# Altium schematic sheet taktik.SchDoc
size A4; SheetNumber: 1; SheetTotal: 1
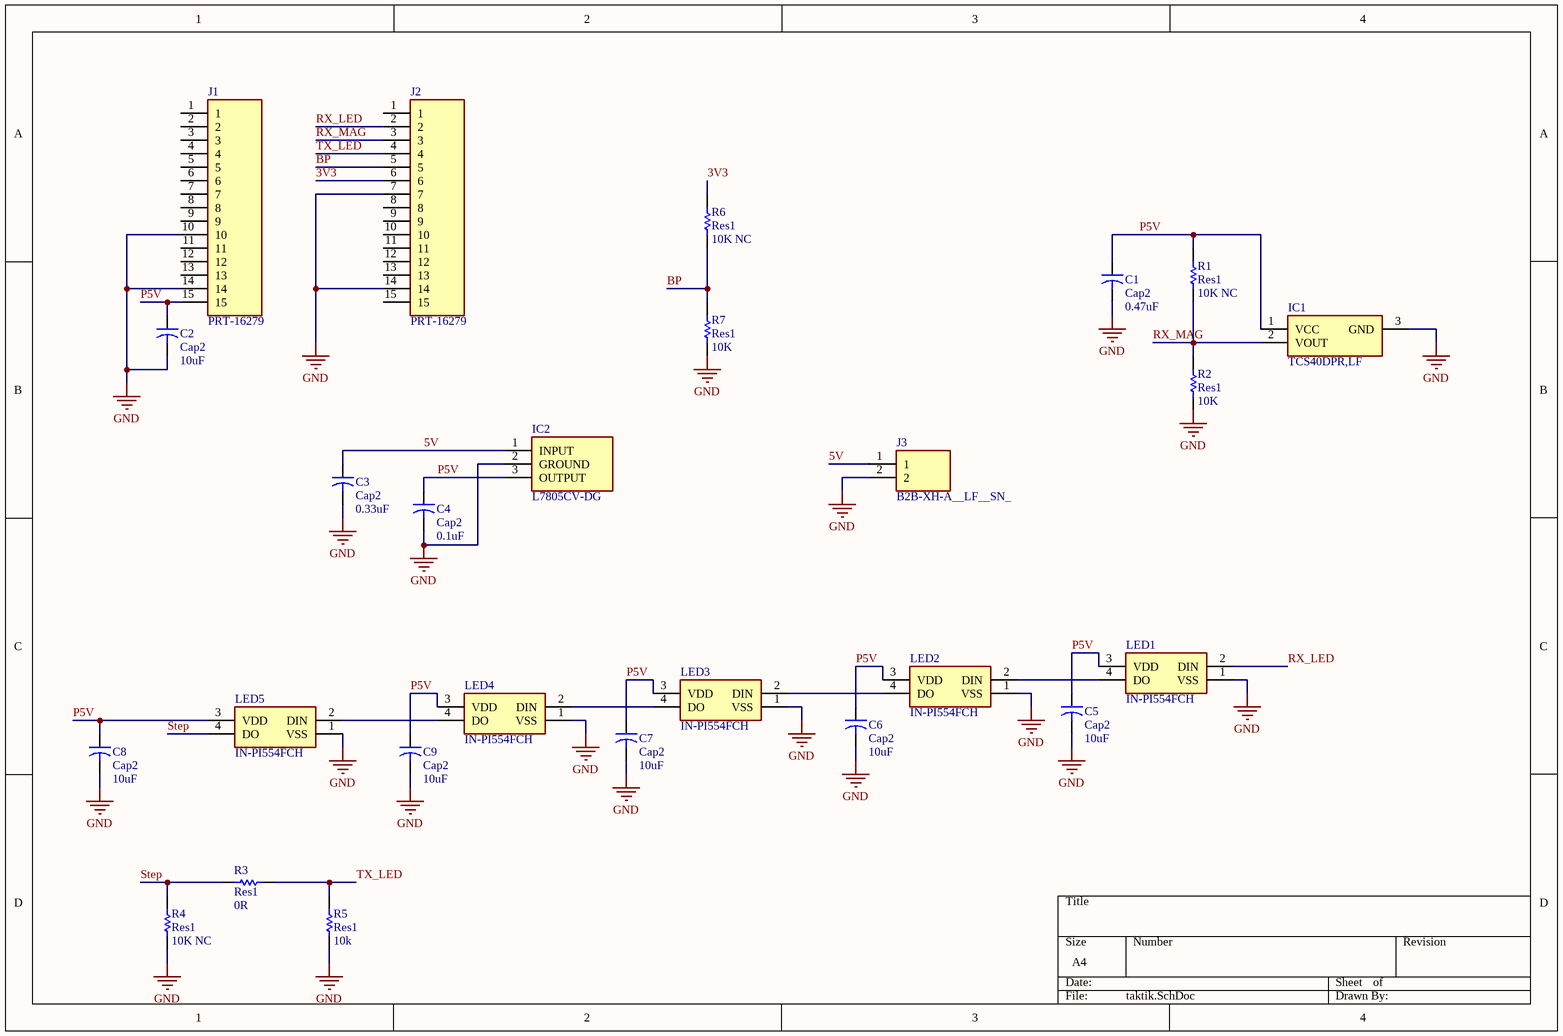
[diagram p0: taktik.SchDoc]

## Parts
C1  Cap2  value 0.47uF  [CAPR5-4X5]
C2  Cap2  value 10uF  [CAPR5-4X5]
C3  Cap2  value 0.33uF  [CAPR5-4X5]
C4  Cap2  value 0.1uF  [CAPR5-4X5]
C5  Cap2  value 10uF  [CAPR5-4X5]
C6  Cap2  value 10uF  [CAPR5-4X5]
C7  Cap2  value 10uF  [CAPR5-4X5]
C8  Cap2  value 10uF  [CAPR5-4X5]
C9  Cap2  value 10uF  [CAPR5-4X5]
IC1  TCS40DPR,LF  [SOTFL95P240X88-3N]
IC2  L7805CV-DG  [TO255P460X1020X2008-3P]
J1  PRT-16279  [PRT16279]
J2  PRT-16279  [PRT16279]
J3  B2B-XH-A__LF__SN_  [SHDR2W64P0X250_1X2_740X575X700P]
LED1  IN-PI554FCH  [INPI554FCH]
LED2  IN-PI554FCH  [INPI554FCH]
LED3  IN-PI554FCH  [INPI554FCH]
LED4  IN-PI554FCH  [INPI554FCH]
LED5  IN-PI554FCH  [INPI554FCH]
R1  Res1  value 10K NC  [AXIAL-0.3]
R2  Res1  value 10K  [AXIAL-0.3]
R3  Res1  value 0R  [AXIAL-0.3]
R4  Res1  value 10K NC  [AXIAL-0.3]
R5  Res1  value 10k  [AXIAL-0.3]
R6  Res1  value 10K NC  [AXIAL-0.3]
R7  Res1  value 10K  [AXIAL-0.3]

## Nets
GND: C1.2 C2.2 C3.2 C4.2 C5.2 C6.2 C7.2 C8.2 C9.2 IC1.3(GND) IC2.2(GROUND) J1.10 J1.14 J2.7 J2.14 J3.2 LED1.1(VSS) LED2.1(VSS) LED3.1(VSS) LED4.1(VSS) LED5.1(VSS) R2.2 R4.2 R5.2 R7.2
3V3: J2.6 R6.1
5V: C3.1 IC2.1(INPUT) J3.1
BP: J2.5 R6.2 R7.1
P5V: C1.1 C2.1 C4.1 C5.1 C6.1 C7.1 C8.1 C9.1 IC1.1(VCC) IC2.3(OUTPUT) J1.15 LED1.3(VDD) LED2.3(VDD) LED3.3(VDD) LED4.3(VDD) LED5.3(VDD) R1.1
RX_LED: J2.2 LED1.2(DIN)
RX_MAG: IC1.2(VOUT) J2.3 R1.2 R2.1
Step: LED5.4(DO) R3.1 R4.1
TX_LED: J2.4 R3.2 R5.1
NetLED1_4: LED1.4(DO) LED2.2(DIN)
NetLED2_4: LED2.4(DO) LED3.2(DIN)
NetLED3_4: LED3.4(DO) LED4.2(DIN)
NetLED4_4: LED4.4(DO) LED5.2(DIN)

Not connected (* = marked no-connect by the designer): J1 1 2 3 4 5 6 7 8 9 11 12 13; J2 1 8 9 10 11 12 13 15

## Library data of the parts
C1-C9 = Cap2: Capacitor; Published: 23-Sep-2002; PackageReference: CAPR5-4X5; Publisher: Altium Limited; PackageDescription: Capacitor; 2 Leads
IC1 = TCS40DPR,LF: Integrated Circuit; Manufacturer_Name: Toshiba; Datasheet Link: http://toshiba.semicon-storage.com/info/docget.jsp?did=30107&prodName=TCS40DPR; Height: 0.88mm; Manufacturer_Part_Number: TCS40DPR,LF; Mouser Part Number: 757-TCS40DPRLF; Mouser Price/Stock: https://www.mouser.co.uk/ProductDetail/Toshiba/TCS40DPRLF?qs=GSXfdiLIrOHqR%252B5sANTKJA%3D%3D; Arrow Part Number: TCS40DPR,LF; Arrow Price/Stock: https://www.arrow.com/en/products/tcs40dprlf/toshiba?region=nac
IC2 = L7805CV-DG: Integrated Circuit; Manufacturer_Name: STMicroelectronics; Datasheet Link: http://www.st.com/web/en/resource/technical/document/datasheet/CD00000444.pdf; Height: 4.6mm; Manufacturer_Part_Number: L7805CV-DG; Mouser Part Number: 511-L7805CV-DG; Mouser Price/Stock: https://www.mouser.co.uk/ProductDetail/STMicroelectronics/L7805CV-DG?qs=T%2FOtf55vL7c3O0as9P9fAw%3D%3D; Arrow Part Number: L7805CV-DG; Arrow Price/Stock: https://www.arrow.com/en/products/l7805cv-dg/stmicroelectronics?region=nac
J1 J2 = PRT-16279: Connector; Manufacturer_Name: SparkFun; Datasheet Link: https://cdn.sparkfun.com/assets/8/d/8/4/7/DS-16279-Arduino_Nano_Stackable_Header_Kit.pdf; Height: 8.65mm; Manufacturer_Part_Number: PRT-16279
J3 = B2B-XH-A__LF__SN_: Connector; Manufacturer_Name: JST (JAPAN SOLDERLESS TERMINALS); Manufacturer_Part_Number: B2B-XH-A (LF)(SN); Datasheet Link: http://www.farnell.com/datasheets/5448.pdf; Height: 7mm
LED1-LED5 = IN-PI554FCH: LED; Manufacturer_Name: Inolux; Datasheet Link: https://www.mouser.com/datasheet/2/180/IN-PI554FCH-1488538.pdf; Height: 1.6mm; Manufacturer_Part_Number: IN-PI554FCH; Mouser Part Number: 743-IN-PI554FCH; Mouser Price/Stock: https://www.mouser.co.uk/ProductDetail/Inolux/IN-PI554FCH?qs=fAHHVMwC%252BbilHshFvT0Xwg%3D%3D; Arrow Part Number: IN-PI554FCH; Arrow Price/Stock: https://www.arrow.com/en/products/in-pi554fch/inolux-corporation?region=nac
R1-R7 = Res1: Resistor; Published: 8-Jun-2000; LatestRevisionDate: 17-Jul-2002; LatestRevisionNote: Re-released for DXP Platform.; PackageReference: AXIAL-0.3; Publisher: Altium Limited; PackageDescription: Axial Device, Thru-Hole; 2 Leads; 0.3 in Pin Spacing